# EAGLE design tiny sat schematic (EAGLE 7.7.0)
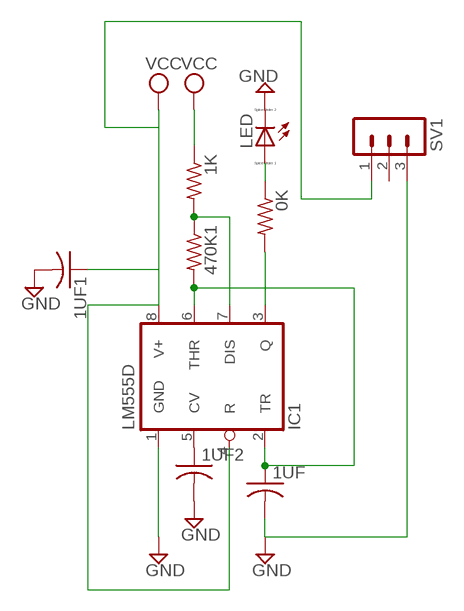
[diagram p0: schematic, sheet 1]

## Parts
0K  R-US_R0805  [R0805]
1K  R-US_R0805  [R0805]
1UF  C-USC0805  [C0805]
1UF1  C-USC0805  [C0805]
1UF2  C-USC0805  [C0805]
470K1  R-US_R0805  [R0805]
IC1  LM555D  [SO08]
LED  LED_ELD260  [LED_LD260]
SV1  MA03-1  [MA03-1]

## Nets
0: 1UF.1 470K1.2 IC1.2(TR) IC1.6(THR)
470K: 0K.2 IC1.3(Q)
GND: 1UF1.2 1UF2.2 1UF.2 IC1.1(GND) LED.K(C) SV1.3
N$2: 1K.2 470K1.1 IC1.7(DIS)
N$3: 1UF2.1 IC1.5(CV)
N$4: 0K.1 LED.A
VCC: 1K.1 1UF1.1 IC1.4(R) IC1.8(V+) SV1.1
Unconnected: SV1.2

## Library data of the parts
0K 1K 470K1 = resistor:R-US_: RESISTOR, American symbol
1UF 1UF1 1UF2 = rcl:C-US: CAPACITOR, American symbol
IC1 = linear:*555: TIMER
LED = eagle-ltspice:LED_E: LED Source: http://www.osram.convergy.de Source: www.luxeon.com Source: www.kingbright.com; SPICEMODEL: NONE; SPICEPREFIX: D; SPICETYPE: diode
SV1 = con-lstb:MA03-1: PIN HEADER; OC_FARNELL: unknown; OC_NEWARK: unknown

## Board
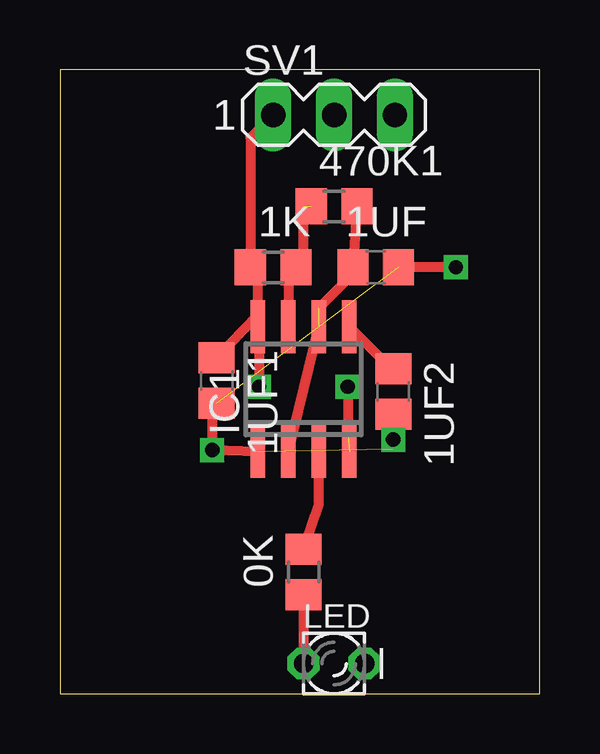
[diagram p1: board, top side]
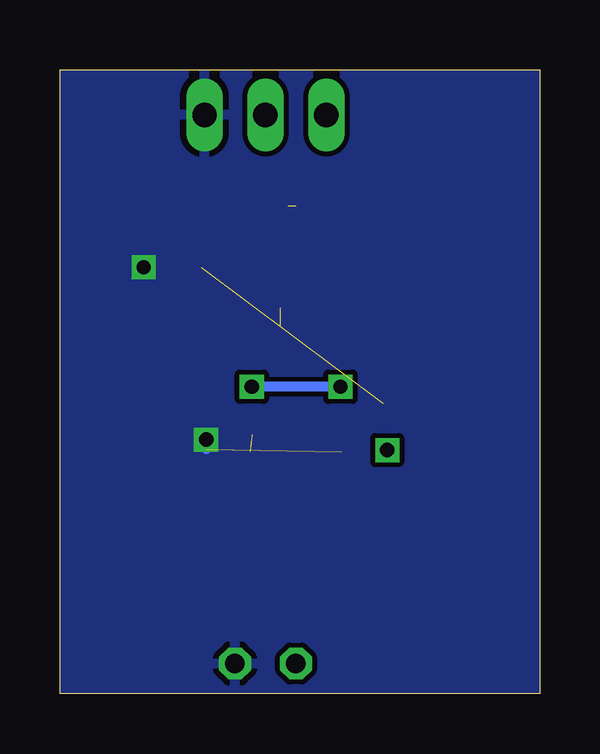
[diagram p2: board, bottom side, seen from below]

Size 20 x 26 mm. Coordinates in mm from the lower left corner, seen from the top.
Outline: 0,0 20,0 20,26 0,26 0,0
Copper layers (1*16): Top 0.035mm / dielectric 1.5mm / GND 0.035mm
Design rules "default *": minimum track width 10mil, minimum drill 24mil, track to track 8mil, track to pad 8mil, pad to pad 8mil, via to via 8mil, smd to smd 8mil, copper to edge 1mil, drill to drill 8mil, minimum pad ring 10mil, minimum via ring 8mil, stop-mask expansion 4mil, vias tented up to drill 0mil, thermal gap 10mil

### Footprints (pad centres in the part's own frame; a part is rotated, then mirrored left to right if it is on the bottom)
R0805 = smd 1.3 x 1.5: 1 -0.95,0; 2 0.95,0
C0805 = smd 1.3 x 1.5: 1 -0.95,0; 2 0.95,0
SO08 = smd 0.6 x 2.2: 1 -1.905,-2.6; 2 -0.635,-2.6; 3 0.635,-2.6; 4 1.905,-2.6; 5 1.905,2.6; 6 0.635,2.6; 7 -0.635,2.6; 8 -1.905,2.6
LED_LD260 = drill 0.813 octagon: A -1.27,0; K 1.27,0
MA03-1 = drill 1.016 long: 1 -2.54,0; 2 0,0; 3 2.54,0

### Placement (x,y rotation side)
0K  10.16,5.08 90 top
1K  8.89,17.78 0 top
1UF  13.17,17.78 0 top
1UF1  6.54,13.06 270 top
1UF2  13.9,12.6 270 top
470K1  11.43,20.32 0 top
IC1  10.16,12.7 0 top
LED  11.43,1.27 0 top
SV1  11.43,24.13 0 top

### Tracks (layer width: path | path; a pad name or v marks a point on that pad's centre or on a via)
0  (1 unrouted)
  Top 0.406: IC1.2 IC1.6 | 470K1.2 1UF.1 12.22,17.52 10.8,16.1
470K
  Top 0.406: 0K.2 10.79,7.93 IC1.3
GND  (via drill 0.6)  (2 unrouted)
  Top 0.406: IC1.1 6.35,10.16 6.35,11.95 6.5,12.1 1UF1.2 | v16.51,17.78 1UF.2 | 1UF2.2 v13.9,10.6
  GND 0.406: v13.9,10.6 13.9,10.2
  pour GND: 0,26.67 21.59,26.67 21.59,0 0,0
N$1  (via drill 0.6)
  other vias: 6.35,10.16
N$2  (1 unrouted)
  Top 0.406: IC1.7 9.53,17.46 1K.2 10.16,18.1 10.16,20.32
N$3
  Top 0.406: IC1.5 13.81,13.55 1UF2.1
N$4
  Top 0.406: 0K.1 LED.A
VCC  (via drill 0.6)  (1 unrouted)
  Top 0.406: 8.26,15.8 IC1.8 8.3,15.26 v8.3,12.8 | 8.26,15.8 8.26,17.78 1K.1 7.94,23.18 SV1.1 | 1UF1.1 8.26,15.8 | v12,12.8 12,10.8
  GND 0.406: v8.3,12.8 v12,12.8